# Altium project ESP32_Projet.PrjPcb
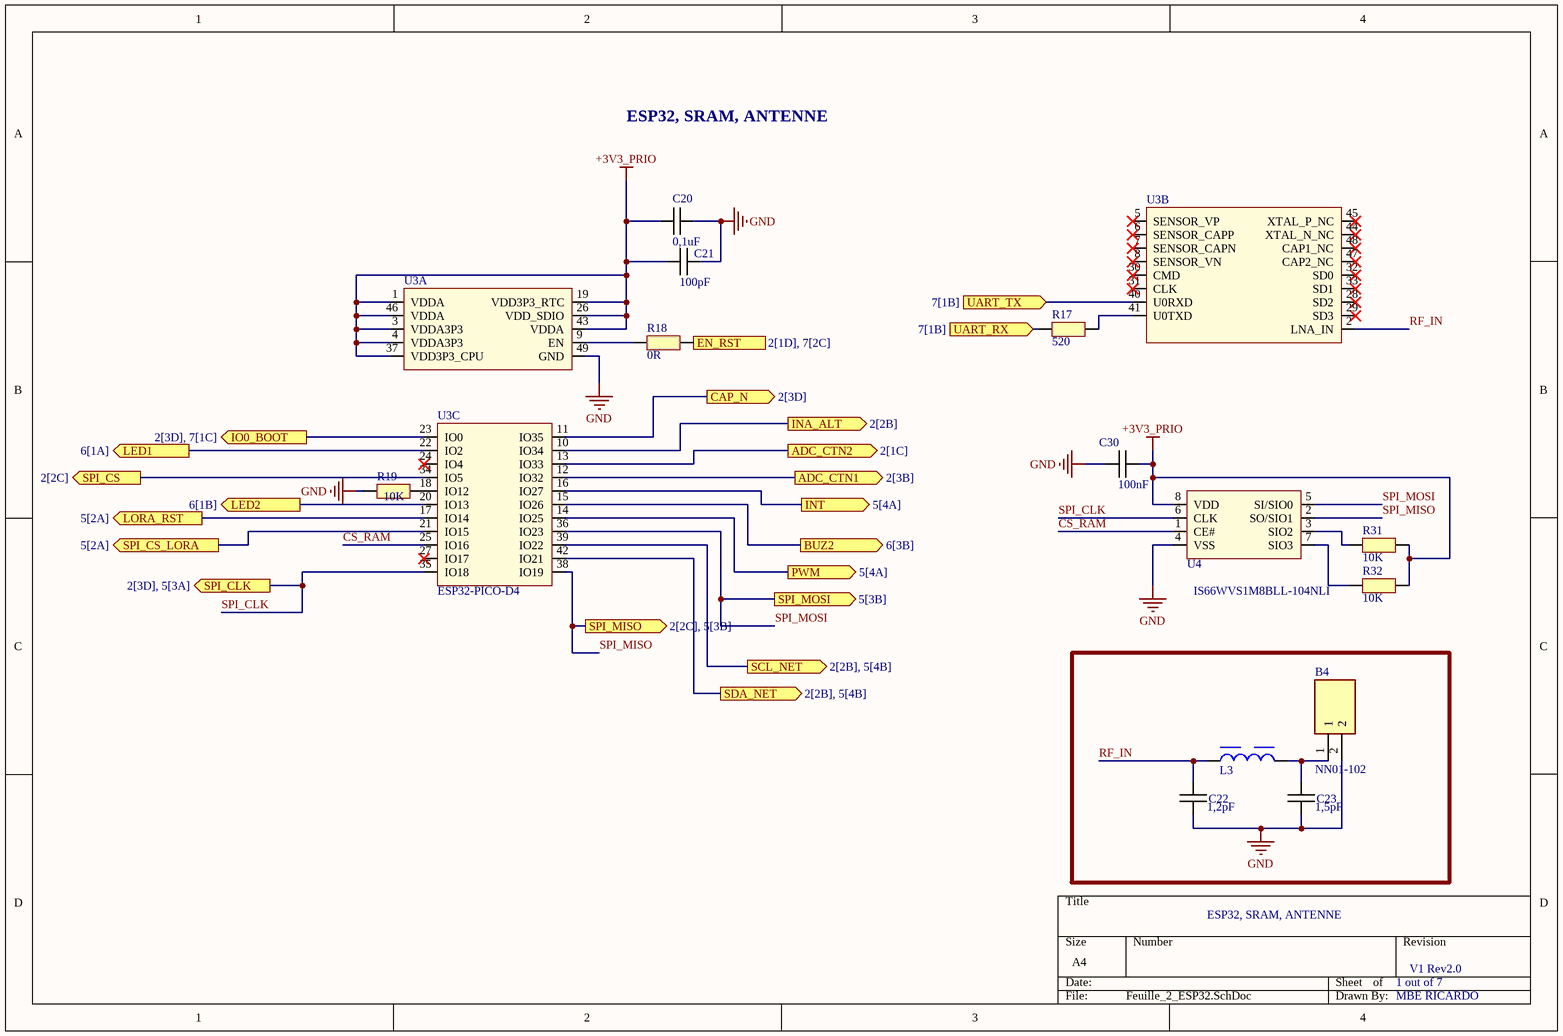
[diagram p0: Feuille_2_ESP32.SchDoc]
7 sheets, 100 parts. Net scope: flat (ports and power ports of the same name join across sheets).
Board file: PCB11.PcbDoc
Sheets:
  Feuille_2_ESP32.SchDoc
  Capteurs.SchDoc
  Circuit de priorité.SchDoc
  Regulateurs.SchDoc
  Connecteurs.SchDoc
  Actionneur.SchDoc
  USB_UART.SchDoc

## Sheet Feuille_2_ESP32.SchDoc
size A4; SheetNumber: 1; SheetTotal: 7

### Parts
B4  NN01-102  [NN01-102]
C20  0,1uF  [CAPC1005X06N]
C21  100pF  [CAPC1005X06N]
C22  1,2pF  [CAPC1005X06N]
C23  1,5pF  [CAPC1005X06N]
C30  100nF  [CAPC1005X06N]
L3  3.3uH, 3.5A  [WE-LHMI_4020]  (value not drawn)
R17  520  [RESC1005X06N]
R18  0R  [RESC1005X06N]
R19  10K  [RESC1005X06N]
R31  10K  [RESC1005X06N]
R32  10K  [RESC1005X06N]
U3  ESP32-PICO-D4  [PQFN50P700X700X104_HS-49N]  (value not drawn)  (parts A,B,C of 3)
U4  IS66WVS1M8BLL-104NLI  [SOIC127P600X175-8N]

### Ports
ADC_CTN1 (out, see 2[3B]), ADC_CTN2 (out, see 2[1C]), BUZ2 (out, see 6[3B]), CAP_N (out, see 2[3D]), EN_RST (out, see 2[1D], 7[2C]), INA_ALT (out, see 2[2B]), INT (out, see 5[4A]), IO0_BOOT (out, see 2[3D], 7[1C]), LED1 (out, see 6[1A]), LED2 (out, see 6[1B]), LORA_RST (out, see 5[2A]), PWM (out, see 5[4A]), SCL_NET (out, see 2[2B], 5[4B]), SDA_NET (out, see 2[2B], 5[4B]), SPI_CLK (out, see 2[3D], 5[3A]), SPI_CS (out, see 2[2C]), SPI_CS_LORA (out, see 5[2A]), SPI_MISO (out, see 2[2C], 5[3B]), SPI_MOSI (out, see 5[3B]), UART_RX (in, see 7[1B]), UART_TX (in, see 7[1B])

### Nets
+3V3_PRIO: C20.1 C21.2 C30.2 R31.1 R32.1 U3.1(VDDA) U3.3(VDDA3P3) U3.4(VDDA3P3) U3.19(VDD3P3_RTC) U3.26(VDD_SDIO) U3.37(VDD3P3_CPU) U3.43(VDDA) U3.46(VDDA) U4.8(VDD)
GND: B4.2 C20.2 C21.1 C22.2 C23.2 C30.1 R19.2 U3.49(GND) U4.4(VSS)
CS_RAM: U3.25(IO16) U4.1(CE#)
RF_IN: C22.1 L3.1 U3.2(LNA_IN)
SCL_NET: U3.39(IO22) ; port SCL_NET
SDA_NET: U3.42(IO21) ; port SDA_NET
SPI_CLK: U3.35(IO18) U4.6(CLK) ; port SPI_CLK
SPI_MISO: U3.38(IO19) U4.2(SO/SIO1) ; port SPI_MISO
SPI_MOSI: U3.36(IO23) U4.5(SI/SIO0) ; port SPI_MOSI
NetB1_2: U3.13(IO33) ; port ADC_CTN2
NetB4_1: B4.1 C23.1 L3.2
NetB5_1: U3.34(IO5) ; port SPI_CS
NetB5_5: U3.11(IO35) ; port CAP_N
NetB6_3: U3.10(IO34) ; port INA_ALT
NetB7_2: U3.12(IO32) ; port ADC_CTN1
NetC5_2: R18.1 ; port EN_RST
NetJ4_9: U3.14(IO25) ; port PWM
NetJ4_10: U3.16(IO27) ; port INT
NetQ2_3: U3.23(IO0) ; port IO0_BOOT
NetR14_1: U3.17(IO14) ; port LORA_RST
NetR15_1: U3.21(IO15) ; port SPI_CS_LORA
NetR16_2: U3.22(IO2) ; port LED1
NetR17_1: R17.1 U3.41(U0TXD)
NetR17_2: R17.2 ; port UART_RX
NetR18_2: R18.2 U3.9(EN)
NetR19_1: R19.1 U3.18(IO12)
NetR24_2: U3.20(IO13) ; port LED2
NetR25_2: U3.15(IO26) ; port BUZ2
NetR31_2: R31.2 U4.3(SIO2)
NetR32_2: R32.2 U4.7(SIO3)
NetU1_20: U3.40(U0RXD) ; port UART_TX

Not connected (* = marked no-connect by the designer): U3 5(SENSOR_VP)* 6(SENSOR_CAPP)* 7(SENSOR_CAPN)* 8(SENSOR_VN)* 24(IO4)* 27(IO17)* 28(SD2)* 29(SD3)* 30(CMD)* 31(CLK)* 32(SD0)* 33(SD1)* 44(XTAL_N_NC)* 45(XTAL_P_NC)* 47(CAP2_NC)* 48(CAP1_NC)*

### Notes on the sheet
- ESP32, SRAM, ANTENNE
- 1 out of 7
- V1 Rev2.0
- MBE RICARDO

### Library data of the parts
B4 = NN01-102: Antennes Compact Reach Xtend 2.4 GHz
C20-C23 C30 = Capacitor
L3 = 74437324033: WE-LHMI SMT Power Inductor, size 4020, 3.3uH, 3.5A, 76mOhm; Manufacturer: Wurth Elektronik; Case/Size Code: 4020; DC Resistance: 69mOhm; Saturation Current @ 10%: 2.75A; Saturation Current @ 30%: 5.45A; Self Resonant Frequency: 40MHz; Manufacturer Part Number: 74437324033; Category: Power Inductors; Match Code: WE-LHMI; ComponentLink1Description: Website Link; ComponentLink1URL: https://www.we-online.com/redexpert/article/74437324033?ad; ComponentLink2Description: Datasheet Link; ComponentLink2URL: https://www.we-online.com/redexpert/spec/74437324033?ad; Mount: Surface Mount; Operating Temperature Max: 125°C; Operating Temperature Min: -40°C; Packaging: Tape and Reel; Length: 4.06mm; Width: 4.06mm; Height: 1.8mm; DC Resistance Max: 76mOhm; Inductance: 3.3uH; Performance Rated Current: 3.5A
R17-R19 R31 R32 = Resistor
U3 = ESP32: Système RF sur puce - SoC SIP module ESP32 with 4MByte Flash, Dual Core MCU, Wi-Fi & Bluetooth Combo, LGA48-pin, 7*7mm; Manufacturer 1: Espressif Systems; Supplier 1: Digi-Key; Supplier Part Number 1: 1904-1029-1-ND; Manufacturer Part Number 1: ESP32-PICO-D4
U4 = SRAM: SRAM 8Mb, SerialRAM, 2.7V-3.6V, 104MHz, 8 pin SOIC 150 mil, RoHS; Manufacturer 1: ISSI; Supplier 1: Digi-Key; Supplier Part Number 1: 706-IS66WVS1M8BLL-104NLI-ND; Manufactuer Part Number 1: IS66WVS1M8BLL-104NLI

## Sheet Capteurs.SchDoc
size A4; SheetNumber: 2; SheetTotal: 7
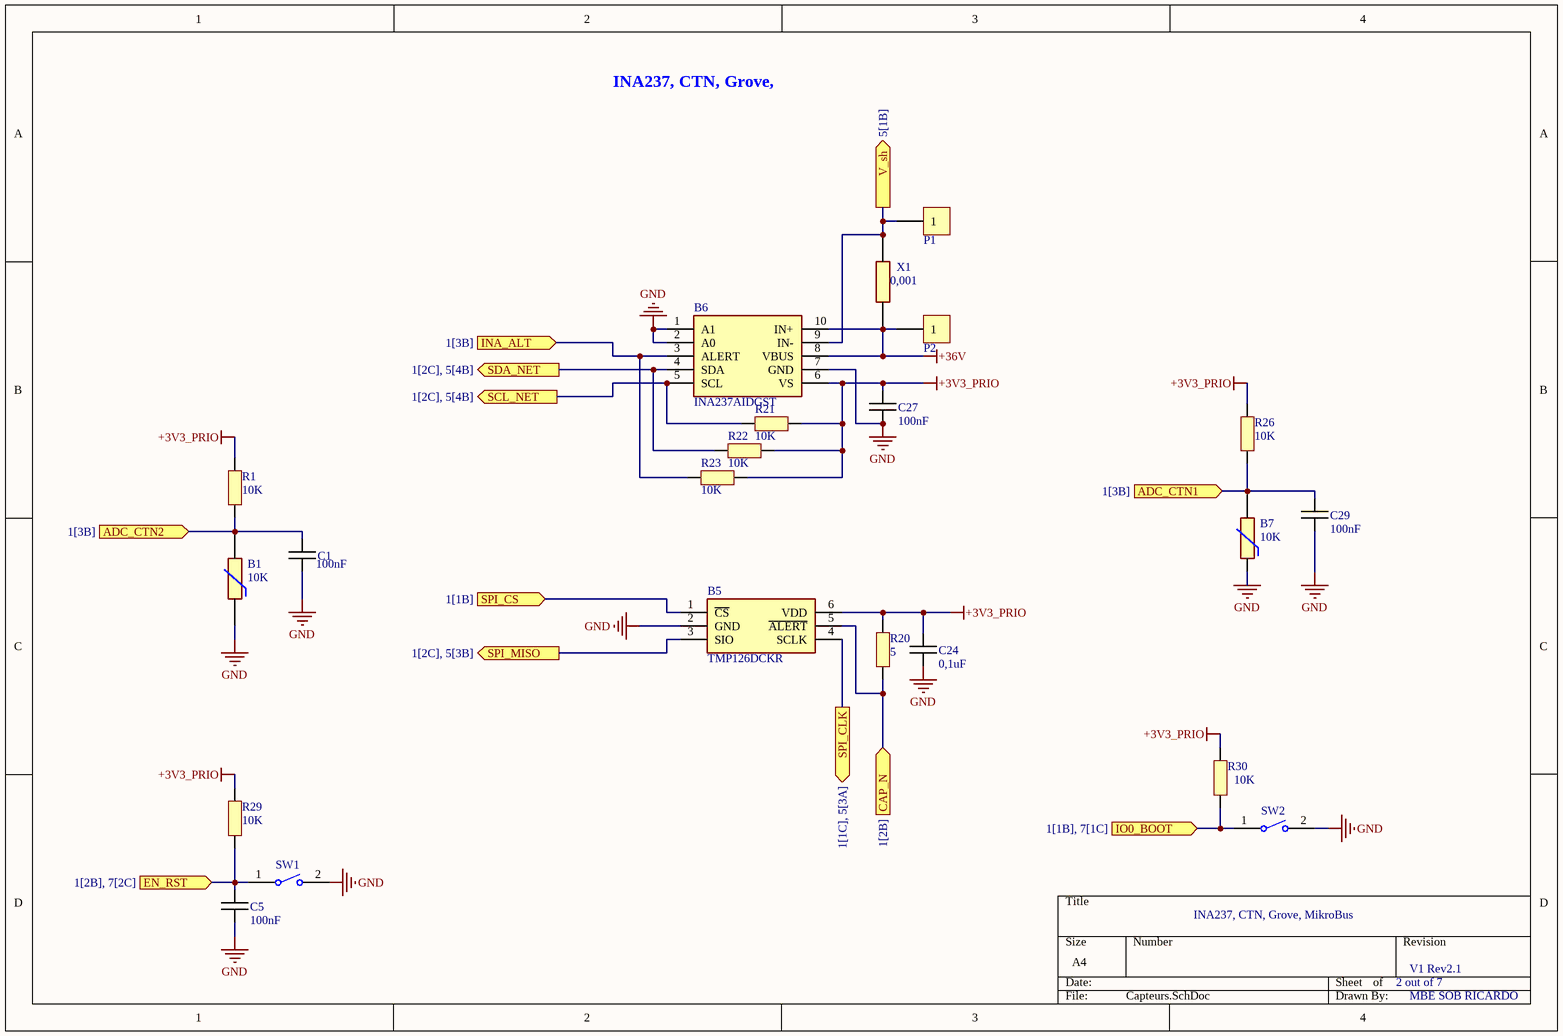
[diagram p1: Capteurs.SchDoc]

### Parts
B1  10K  [RESC2212X50N]
B5  TMP126DCKR  [SOT65P210X110-6N]
B6  INA237AIDGST  [SOP50P490X110-10N]
B7  10K  [RESC2212X50N]
C1  100nF  [CAPC1005X06N]
C5  100nF  [CAPC1005X06N]
C24  0,1uF  [CAPC1005X06N]
C27  100nF  [CAPC1005X06N]
C29  100nF  [CAPC1005X06N]
P1  Plage CMS 10x5  [Plage CMS 10x5]  (value not drawn)  (no BOM)
P2  Plage CMS 10x5  [Plage CMS 10x5]  (value not drawn)  (no BOM)
R1  10K  [RESC1005X06N]
R20  5  [RESC1005X06N]
R21  10K  [RESC1005X06N]
R22  10K  [RESC1005X06N]
R23  10K  [RESC1005X06N]
R26  10K  [RESC1005X06N]
R29  10K  [RESC1005X06N]
R30  10K  [RESC1005X06N]
SW1  FSMSM  [TECO-FSMSM-2_V]  (value not drawn)
SW2  FSMSM  [TECO-FSMSM-2_V]  (value not drawn)
X1  0,001  [RESC10052X200N]

### Ports
ADC_CTN1 (in, see 1[3B]), ADC_CTN2 (in, see 1[3B]), CAP_N (in, see 1[2B]), EN_RST (in, see 1[2B], 7[2C]), INA_ALT (in, see 1[3B]), IO0_BOOT (in, see 1[1B], 7[1C]), SCL_NET (out, see 1[2C], 5[4B]), SDA_NET (out, see 1[2C], 5[4B]), SPI_CLK (out, see 1[1C], 5[3A]), SPI_CS (in, see 1[1B]), SPI_MISO (out, see 1[2C], 5[3B]), V_sh (out, see 5[1B])

### Nets
+3V3_PRIO: B5.6(VDD) B6.6(VS) C24.1 C27.2 R1.2 R20.2 R21.1 R22.1 R23.1 R26.2 R29.1 R30.1
+36V: B6.8(VBUS) B6.10(IN+) P2.1 X1.1
GND: B1.1 B5.2(GND) B6.1(A1) B6.2(A0) B6.7(GND) B7.1 C1.2 C5.1 C24.2 C27.1 C29.1 SW1.2 SW2.2
SCL_NET: B6.5(SCL) R21.2 ; port SCL_NET
SDA_NET: B6.4(SDA) R22.2 ; port SDA_NET
SPI_CLK: B5.4(SCLK) ; port SPI_CLK
SPI_MISO: B5.3(SIO) ; port SPI_MISO
NetB1_2: B1.2 C1.1 R1.1 ; port ADC_CTN2
NetB5_1: B5.1(~{CS}) ; port SPI_CS
NetB5_5: B5.5(~{ALERT}) R20.1 ; port CAP_N
NetB6_3: B6.3(ALERT) R23.2 ; port INA_ALT
NetB6_9: B6.9(IN-) P1.1 X1.2 ; port V_sh
NetB7_2: B7.2 C29.2 R26.1 ; port ADC_CTN1
NetC5_2: C5.2 R29.2 SW1.1 ; port EN_RST
NetQ2_3: R30.2 SW2.1 ; port IO0_BOOT

### Notes on the sheet
- INA237, CTN, Grove, MikroBus
- 2 out of 7
- V1 Rev2.1
- MBE SOB RICARDO

### Library data of the parts
B1 B7 = NB12K00103JBB: NTC SMD Thermistor, NB12K, 10K, 5% AVX 10k 0805 Protection NTC Thermistor, 5s, 2 x 1.25 x 1.3mm; Manufacturer_Name: Kyocera AVX; Geometry.Height: 0.5mm; Manufacturer_Part_Number: NB12K00103JBB; Mouser Part Number: 581-NB12K00103JBB; Mouser Price/Stock: https://www.mouser.co.uk/ProductDetail/AVX/NB12K00103JBB/?qs=4%252B6%252BTdINQeDPvI%252BQUQjJ3Q%3D%3D; Arrow Part Number: NB12K00103JBB; Arrow Price/Stock: https://www.arrow.com/en/products/nb12k00103jbb/avx; Datasheet Link: https://datasheet.datasheetarchive.com/originals/distributors/Datasheets-DGA6/551314.pdf
B5 = TMP126DCKR: Board Mount Temperature Sensors +/-0.25 C SPI temperature sensor with 175 C operation, CRC and slew-rate alert; Manufacturer_Name: Texas Instruments; Manufacturer_Part_Number: TMP126DCKR; Mouser Part Number: 595-TMP126DCKR
B6 = INA237AIDGST: Current Sense Amplifiers 85-V, 16-bit, I2C output current/voltage/power monitor with alert 10-VSSOP -40 to 125; Manufacturer_Name: Texas Instruments; Manufacturer_Part_Number: INA237AIDGST; Mouser Part Number: 595-INA237AIDGST
C1 C5 C24 C27 C29 = Capacitor
P1 P2 = Plage CMS 10x5: Plage de report CMS 10x5mm; PN: L30; Value: Plage CMS 10x5; Footprint_statut: ok
R1 R20-R23 R26 R29 R30 = Resistor
SW1 SW2 = CMP-2000-07511-1: FSMSM Push Button Switch, 50 mA, -35 to 85 degC, 2-Pin SMD, RoHS, Bulk; Manufacturer: TE Connectivity; Actuator Length: 1.07mm; Electrical Life: 20000Cycles; Actuator Material: Polyamide; Current Rating: 50mA; Illumination Type: Illuminated; Voltage Rating (DC): 24V; Contact Resistance: 100mOhm; Case\/Package: SMD/SMT; Operating Force: 180gf; Switch Travel: 0.25mm; Max Voltage Rating (DC): 12V; Throw Configuration: SPST; Packaging: LoosePiece; Max Operating Temperature: 85degC; ELV: Compliant; Package Description: 2-Pin Surface Mount Device, Body 6 x 3.5 mm, Pitch 9.19 mm; RoHSCompliant: true; Manufacturer URL: http://www.te.com/; Contact Plating: Silver; Contact Material: Brass; Mounting Technology: SurfaceMount; Contact Current Rating: 50mA; Datasheet Version: Rev. C2, 08/2014; Datasheet URL: http://www.te.com/commerce/DocumentDelivery/DDEController?Action=showdoc&DocId=Customer+Drawing%7F1437566-3%7FC2%7Fpdf%7FEnglish%7FENG_CD_1437566-3_C2_1437566_3_1_c.dwg.pdf%7F1437566-3; Mechanical Life: 20000Cycles; Package Reference: FSMSM; REACH SVHC: Unknown; Orientation: Straight; Min Operating Temperature: -35degC; Lead Free: LeadFree; Termination: GullWing; Package Quantity: 1000; Mount: SurfaceMount
X1 = PSR400ITQFF0L50: ROHM - PSR400ITQFF0L50 - SMD Current Sense Resistor, 500 ohm, PSR Series, 3921 [1052 Metric], 4 W, +/- 1%, Metal Strip; Manufacturer_Name: ROHM Semiconductor; Geometry.Height: 2mm; Manufacturer_Part_Number: PSR400ITQFF0L50; Mouser Part Number: 755-PSR400ITQFF0L50; Mouser Price/Stock: https://www.mouser.co.uk/ProductDetail/ROHM-Semiconductor/PSR400ITQFF0L50?qs=493kPxzlxfLaT1w5Mo%252BtHg%3D%3D; Arrow Part Number: *; Arrow Price/Stock: *; Datasheet Link: https://componentsearchengine.com/Datasheets/2/PSR400ITQFF0L50.pdf

## Sheet Circuit de priorité.SchDoc
size A4; SheetNumber: 3; SheetTotal: 7
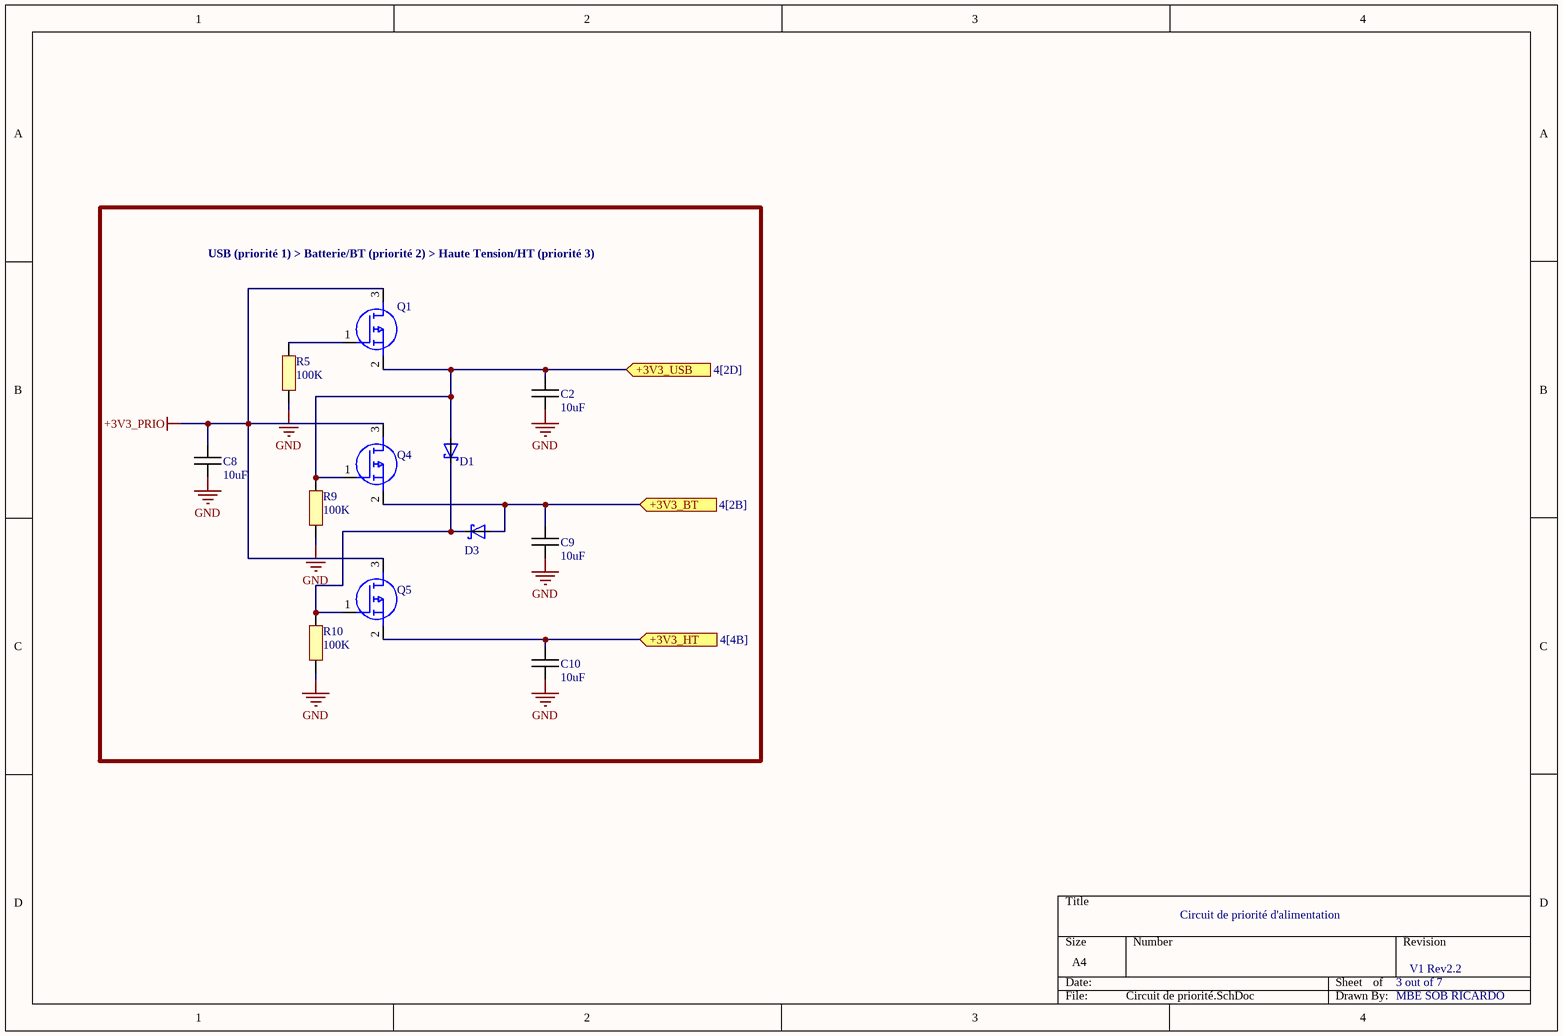
[diagram p2: Circuit de priorité.SchDoc]

### Parts
C2  10uF  [CAPC1005X06N]
C8  10uF  [CAPC1005X06N]
C9  10uF  [CAPC1005X06N]
C10  10uF  [CAPC1005X06N]
D1  SD103AWS-7-F  [SD103AWS-7-F]  (value not drawn)
D3  SD103AWS-7-F  [SD103AWS-7-F]  (value not drawn)
Q1  SI3139K-TP  [SI3139K-TP]  (value not drawn)
Q4  SI3139K-TP  [SI3139K-TP]  (value not drawn)
Q5  SI3139K-TP  [SI3139K-TP]  (value not drawn)
R5  100K  [RESC1005X06N]
R9  100K  [RESC1005X06N]
R10  100K  [RESC1005X06N]

### Ports
+3V3_BT (in, see 4[2B]), +3V3_HT (in, see 4[4B]), +3V3_USB (in, see 4[2D])

### Nets
+3V3_PRIO: C8.1 Q1.3(D) Q4.3(D) Q5.3(D)
GND: C2.2 C8.2 C9.2 C10.2 R5.2 R9.2 R10.2
NetB2_5: C9.1 D3.2(A) Q4.2(S) ; port +3V3_BT
NetC2_1: C2.1 D1.2(A) Q1.2(S) Q4.1(G) R9.1 ; port +3V3_USB
NetC10_1: C10.1 Q5.2(S) ; port +3V3_HT
NetD1_1: D1.1(C) D3.1(C) Q5.1(G) R10.1
NetQ1_1: Q1.1(G) R5.1

### Notes on the sheet
- (near Q1) USB (priorité 1) > Batterie/BT (priorité 2) > Haute Tension/HT (priorité 3)
- Circuit de priorité d'alimentation
- 3 out of 7
- V1 Rev2.2
- MBE SOB RICARDO

### Library data of the parts
C2 C8-C10 = Capacitor
D1 D3 = SD103AWS-7-F: Diode Array 3 Independent Schottky 40V 175mA Surface Mount 6-TSSOP, SC-88, SOT-363
Q1 Q4 Q5 = SI3139K-TP: MOSFET P-Channel MOSFET
R5 R9 R10 = Resistor

## Sheet Regulateurs.SchDoc
size A4; SheetNumber: 4; SheetTotal: 7
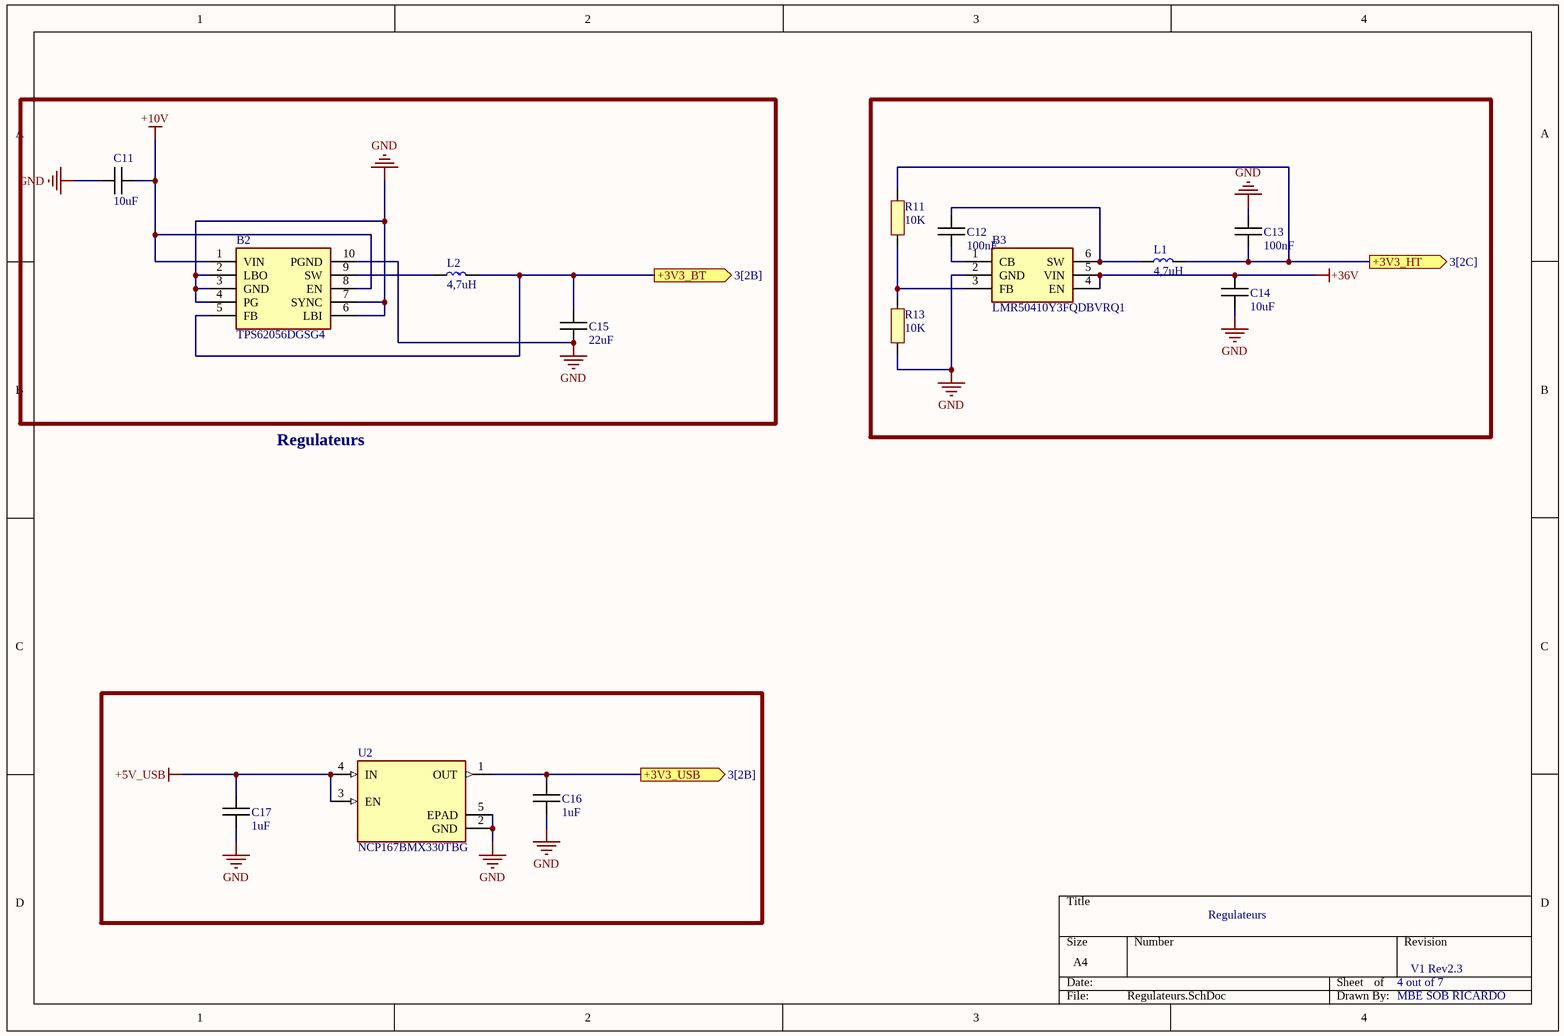
[diagram p3: Regulateurs.SchDoc]

### Parts
B2  TPS62056DGSG4  [SOP50P490X110-10N]
B3  LMR50410Y3FQDBVRQ1  [SOT95P280X145-6N]
C11  10uF  [CAPC1005X06N]
C12  100nF  [CAPC1005X06N]
C13  100nF  [CAPC1005X06N]
C14  10uF  [CAPC1005X06N]
C15  22uF  [CAPC1005X06N]
C16  1uF  [CAPC1005X06N]
C17  1uF  [CAPC1005X06N]
L1  4,7uH  [LQPC1005X06N]
L2  4,7uH  [LQPC1005X06N]
R11  10K  [RESC1005X06N]
R13  10K  [RESC1005X06N]
U2  NCP167BMX330TBG  [NCP167BMX330TBG]

### Ports
+3V3_BT (out, see 3[2B]), +3V3_HT (out, see 3[2C]), +3V3_USB (out, see 3[2B])

### Nets
+5V_USB: C17.2 U2.3(EN) U2.4(IN)
+10V: B2.1(VIN) B2.8(EN) C11.1
+36V: B3.4(EN) B3.5(VIN) C14.2
GND: B2.2(LBO) B2.3(GND) B2.4(PG) B2.6(LBI) B2.7(SYNC) B2.10(PGND) B3.2(GND) C11.2 C13.2 C14.1 C15.2 C16.1 C17.1 R13.1 U2.2(GND) U2.5(EPAD)
NetB2_5: B2.5(FB) C15.1 L2.2 ; port +3V3_BT
NetB2_9: B2.9(SW) L2.1
NetB3_1: B3.1(CB) C12.1
NetB3_3: B3.3(FB) R11.1 R13.2
NetB3_6: B3.6(SW) C12.2 L1.1
NetC2_1: C16.2 U2.1(OUT) ; port +3V3_USB
NetC10_1: C13.1 L1.2 R11.2 ; port +3V3_HT

### Notes on the sheet
- Regulateurs
- 4 out of 7
- V1 Rev2.3
- MBE SOB RICARDO

### Library data of the parts
B2 = TPS62056DGSG4: TEXAS INSTRUMENTS - TPS62056DGSG4 - Synchronous Buck (Step Down) Switching Regulator, Fixed, 2.7V-10Vin, 3.3V/0.8A out, 850kHz, VSSOP-10; Manufacturer_Name: Texas Instruments; Manufacturer_Part_Number: TPS62056DGSG4; Mouser Part Number: 595-TPS62056DGSG4
B3 = LMR50410Y3FQDBVRQ1: Régulateurs de tension de commutation Automotive qualified SIMPLE SWITCHER 4-V to 36-V, 1-A synchronous step-down converter 6-SOT-23 -40 to 150; Manufacturer_Name: Texas Instruments; Manufacturer_Part_Number: LMR50410Y3FQDBVRQ1; Mouser Part Number: 595-R50410Y3FQDBVRQ1
C11-C17 = Capacitor
L1 L2 = Bobine
R11 R13 = Resistor
U2 = NCP167BMX330TBG: Régulateurs de tension LDO LDO 700 MA ULTRA-LOW NOISE 3.3V

## Sheet Connecteurs.SchDoc
size A4; SheetNumber: 5; SheetTotal: 7
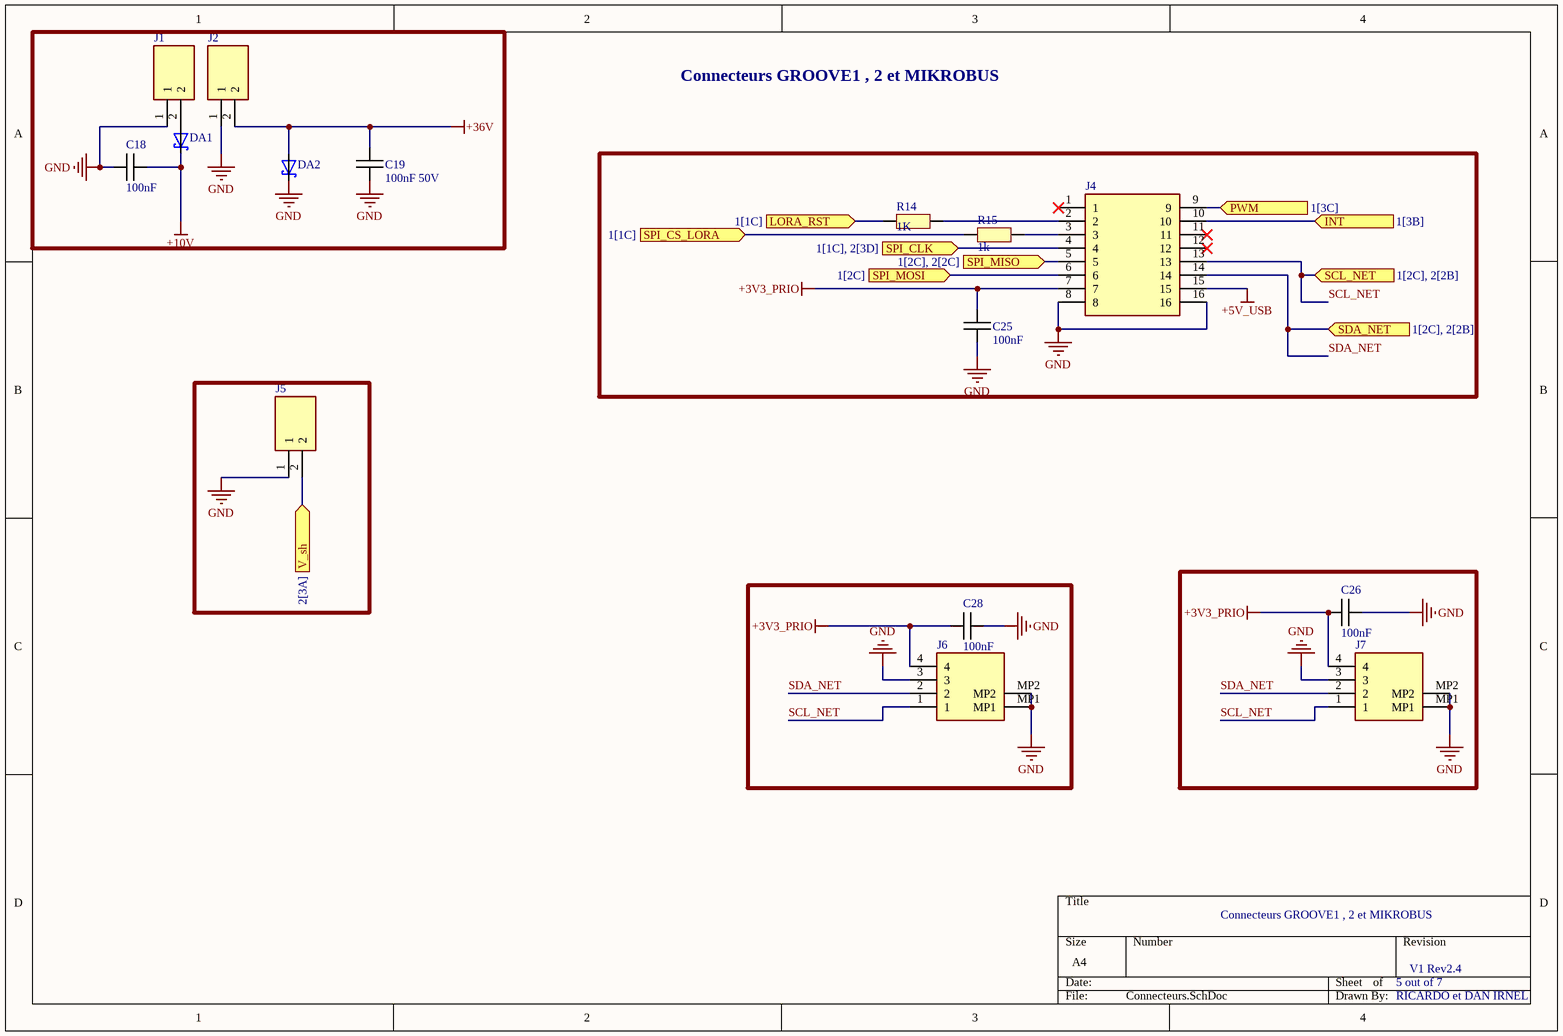
[diagram p4: Connecteurs.SchDoc]

### Parts
C18  100nF  [CAPC1005X06N]
C19  100nF 50V  [CAPC1005X06N]
C25  100nF  [CAPC1005X06N]
C26  100nF  [CAPC1005X06N]
C28  100nF  [CAPC1005X06N]
DA1  SD103AWS-7-F  [SD103AWS-7-F]  (value not drawn)
DA2  SD103AWS-7-F  [SD103AWS-7-F]  (value not drawn)
J1  61300211121  [61300211121]  (value not drawn)
J2  61300211121  [61300211121]  (value not drawn)
J4  825433-8  [Connect-Mikrobus]  (value not drawn)
J5  61300211121  [61300211121]  (value not drawn)
J6  114020164  [114020164]  (value not drawn)
J7  114020164  [114020164]  (value not drawn)
R14  1K  [RESC1005X06N]
R15  1k  [RESC1005X06N]

### Ports
INT (in, see 1[3B]), LORA_RST (in, see 1[1C]), PWM (in, see 1[3C]), SCL_NET (in, see 1[2C], 2[2B]), SDA_NET (in, see 1[2C], 2[2B]), SPI_CLK (in, see 1[1C], 2[3D]), SPI_CS_LORA (in, see 1[1C]), SPI_MISO (in, see 1[2C], 2[2C]), SPI_MOSI (in, see 1[2C]), V_sh (in, see 2[3A])

### Nets
+3V3_PRIO: C25.1 C26.2 C28.2 J4.7 J6.4 J7.4
+5V_USB: J4.15
+10V: C18.1 DA1.1(C)
+36V: C19.1 DA2.2(A) J2.2
GND: C18.2 C19.2 C25.2 C26.1 C28.1 DA2.1(C) J1.1 J2.1 J4.8 J4.16 J5.1 J6.3 J6.MP1 J6.MP2 J7.3 J7.MP1 J7.MP2
SCL_NET: J4.13 J6.1 J7.1 ; port SCL_NET
SDA_NET: J4.14 J6.2 J7.2 ; port SDA_NET
SPI_CLK: J4.4 ; port SPI_CLK
SPI_MISO: J4.5 ; port SPI_MISO
SPI_MOSI: J4.6 ; port SPI_MOSI
NetB6_9: J5.2 ; port V_sh
NetDA1_2: DA1.2(A) J1.2
NetJ4_2: J4.2 R14.2
NetJ4_3: J4.3 R15.2
NetJ4_9: J4.9 ; port PWM
NetJ4_10: J4.10 ; port INT
NetR14_1: R14.1 ; port LORA_RST
NetR15_1: R15.1 ; port SPI_CS_LORA

Not connected (* = marked no-connect by the designer): J4 1* 11* 12*

### Notes on the sheet
- Connecteurs GROOVE1 , 2 et MIKROBUS
- 5 out of 7
- V1 Rev2.4
- RICARDO et DAN IRNEL

### Library data of the parts
C18 C19 C25 C26 C28 = Capacitor
DA1 DA2 = SD103AWS-7-F: as D1 on sheet Circuit de priorité
J1 J2 J5 = 61300211121: WURTH ELEKTRONIK - 61300211121 - HEADER, 2.54MM, PIN, THT, VERTICAL, 2WAY
J4 = Connect-Mikrobus: Headers & Wire Housings 8P double for connection mikrobus; Manufacturer_Name: TE Connectivity; Manufacturer_Part_Number: 825433-8; Mouser Part Number: 571-825433-8
J6 J7 = 114020164: Seeed Studio Accessories Grove Female Header - SMD-4P-2.0mm-90D-20Pcs; Manufacturer_Name: Seeed Studio; Manufacturer_Part_Number: 114020164; Mouser Part Number: 713-114020164
R14 R15 = Resistor

## Sheet Actionneur.SchDoc
size A4; SheetNumber: 6; SheetTotal: 7
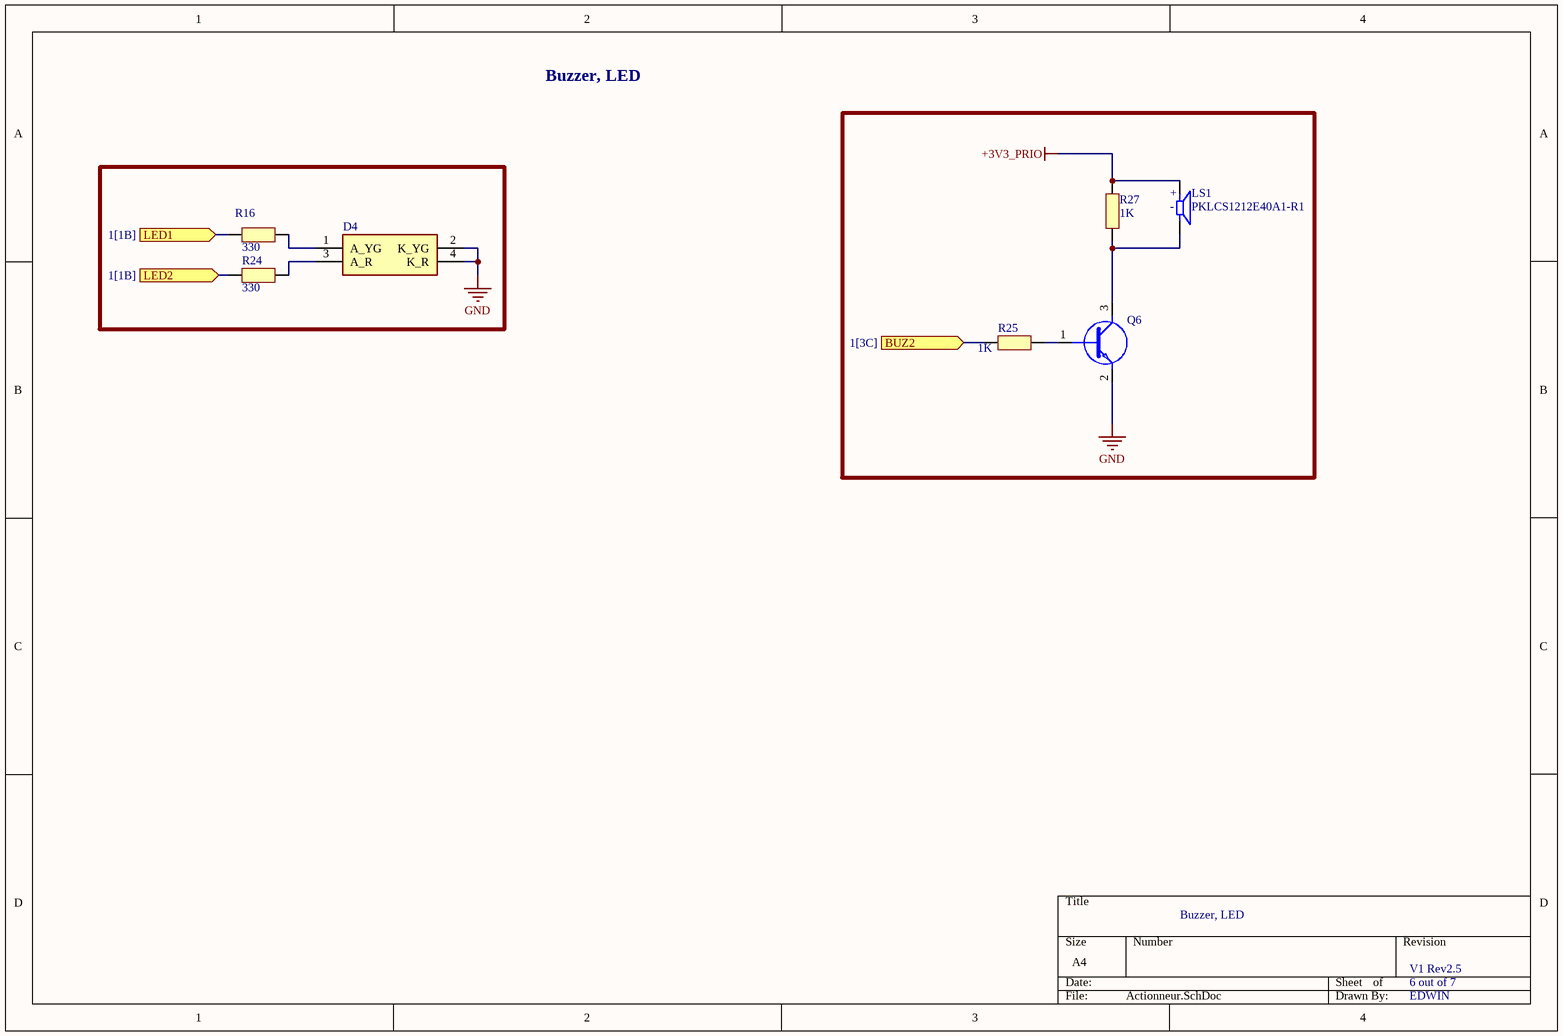
[diagram p5: Actionneur.SchDoc]

### Parts
D4  598-8610-207F  [5988610207F]  (value not drawn)
LS1  PKLCS1212E40A1-R1  [SPKR_PKLCS1212E40A1-R1]
Q6  SS8050-G  [SS8050-G]  (value not drawn)
R16  330  [RESC1005X06N]
R24  330  [RESC1005X06N]
R25  1K  [RESC1005X06N]
R27  1K  [RESC1005X06N]

### Ports
BUZ2 (in, see 1[3C]), LED1 (in, see 1[1B]), LED2 (in, see 1[1B])

### Nets
+3V3_PRIO: LS1.P R27.1
GND: D4.2(K_YG) D4.4(K_R) Q6.2(E)
NetD4_1: D4.1(A_YG) R16.1
NetD4_3: D4.3(A_R) R24.1
NetLS1_N: LS1.N Q6.3(C) R27.2
NetQ6_1: Q6.1(B) R25.1
NetR16_2: R16.2 ; port LED1
NetR24_2: R24.2 ; port LED2
NetR25_2: R25.2 ; port BUZ2

### Notes on the sheet
- Buzzer, LED
- 6 out of 7
- V1 Rev2.5
- EDWIN
- (in symbol PKLCS1212E40A1-R1) +; -

### Library data of the parts
D4 = 598-8610-207F: Standard LEDs - SMD Red/Green WC 80/50mcd 645/570nm; Manufacturer_Name: Dialight; Geometry.Height: 0.8mm; Manufacturer_Part_Number: 598-8610-207F; Mouser Part Number: 645-598-8610-207F; Mouser Price/Stock: https://www.mouser.co.uk/ProductDetail/Dialight/598-8610-207F?qs=7JStj%2FjQ2SFuCjosqwklHQ%3D%3D; Arrow Part Number: 598-8610-207F; Arrow Price/Stock: https://www.arrow.com/en/products/598-8610-207f/dialight?region=nac; Datasheet Link: https://media.digikey.com/pdf/Data%20Sheets/Dialight%20PDFs/598%20Series%201210%20Pkg%20Bi-Color.pdf
LS1 = PKLCS1212E40A1-R1: Buzzers Transducer, Externally Driven Piezo 1.5V 2kHz 70dB @ 1.5V, 10cm Surface Mount Solder Pads; MF: Murata Electronics; Value: *; MP: PKLCS1212E40A1-R1; Package: None; Availability: Unavailable; Price: None
Q6 = SS8050-G: Bipolar Transistors - BJT NPN TRANSISTOR 1.5A 40V
R16 R24 R25 R27 = Resistor

## Sheet USB_UART.SchDoc
size A4; SheetNumber: 7; SheetTotal: 7
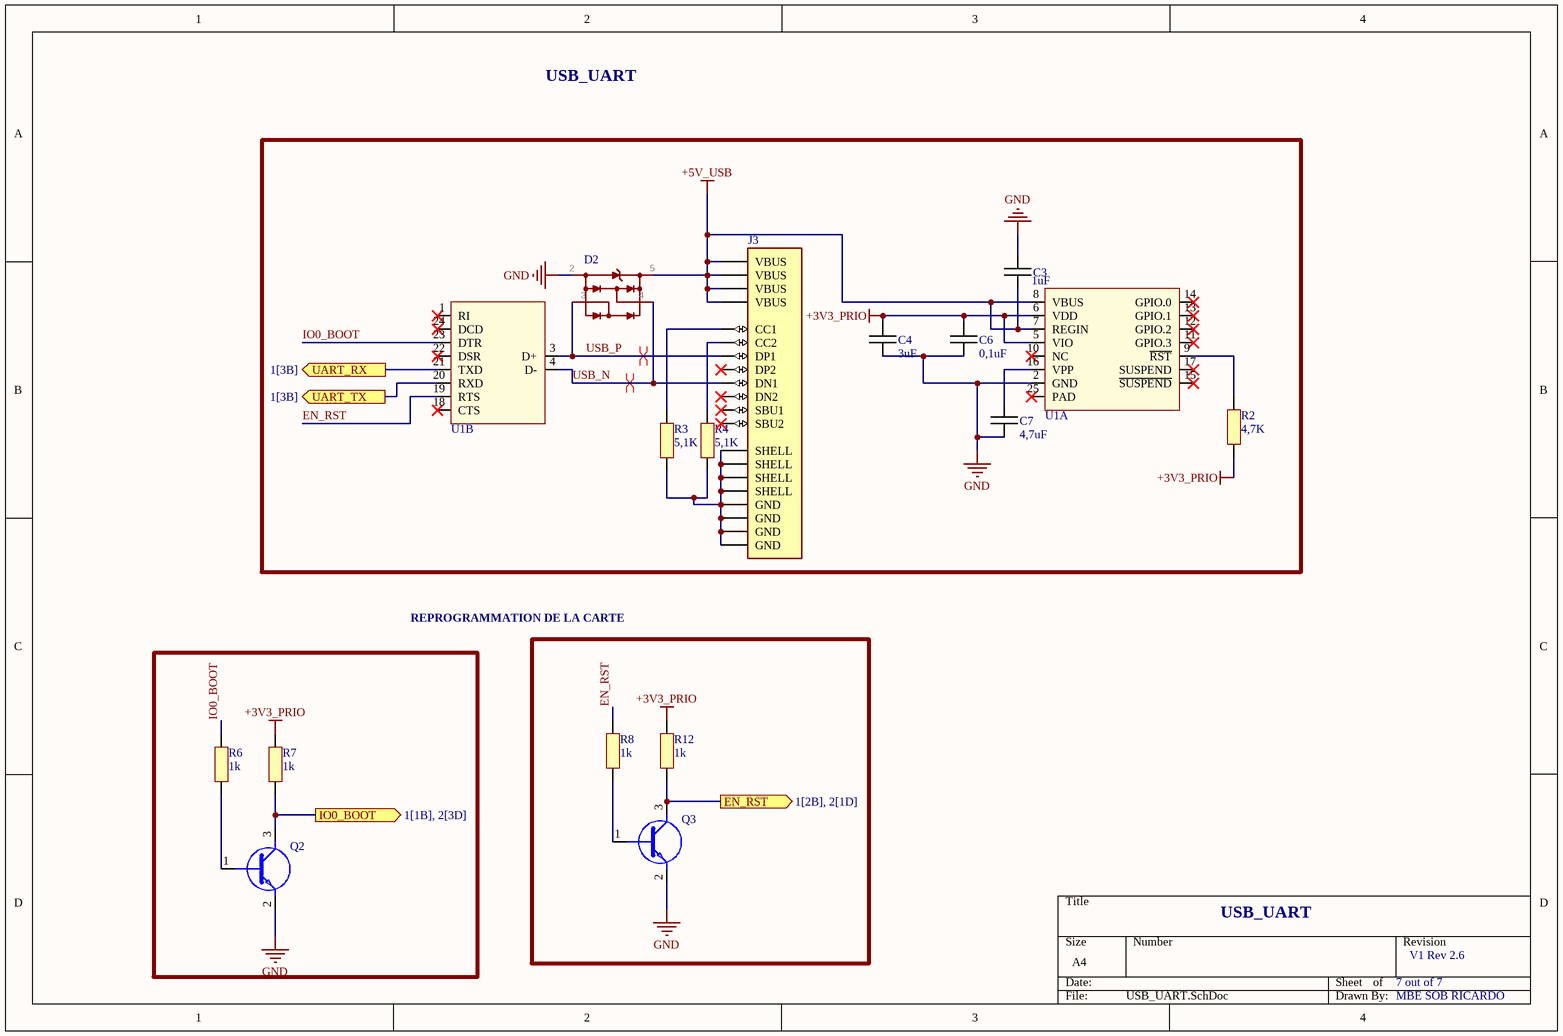
[diagram p6: USB_UART.SchDoc]

### Parts
C3  1uF  [CAPC1005X06N]
C4  3uF  [CAPC1005X06N]
C6  0,1uF  [CAPC1005X06N]
C7  4,7uF  [CAPC1005X06N]
D2  824011  [824011]  (value not drawn)
J3  Use  [USB4085-GF-A]  (value not drawn)
Q2  SS8050-G  [SS8050-G]  (value not drawn)
Q3  SS8050-G  [SS8050-G]  (value not drawn)
R2  4,7K  [RESC1005X06N]
R3  5,1K  [RESC1005X06N]
R4  5,1K  [RESC1005X06N]
R6  1k  [RESC1005X06N]
R7  1k  [RESC1005X06N]
R8  1k  [RESC1005X06N]
R12  1k  [RESC1005X06N]
U1  CP2104-F03-GM  [PQFN50P400X400X80_HS-25N]  (value not drawn)  (parts A,B of 2)

### Ports
EN_RST (out, see 1[2B], 2[1D]), IO0_BOOT (out, see 1[1B], 2[3D]), UART_RX (out, see 1[3B]), UART_TX (out, see 1[3B])

### Nets
+3V3_PRIO: C4.1 C6.1 R2.2 R7.1 R12.1 U1.5(VIO) U1.6(VDD)
+5V_USB: C3.2 D2.5(VDD) J3.A4(VBUS) J3.A9(VBUS) J3.B4(VBUS) J3.B9(VBUS) U1.7(REGIN) U1.8(VBUS)
GND: C3.1 C4.2 C6.2 C7.2 D2.2(GND) Q2.2(E) Q3.2(E) U1.2(GND)
EN_RST: R8.1 U1.19(RTS)
IO0_BOOT: R6.1 U1.23(DTR)
USB_N: D2.4 J3.A7(DN1) U1.4(D-)
USB_P: D2.3 J3.A6(DP1) U1.3(D+)
NetC5_2: Q3.3(C) R12.2 ; port EN_RST
NetC7_1: C7.1 U1.16(VPP)
NetJ3_A1: J3.A1(GND) J3.A12(GND) J3.B1(GND) J3.B12(GND) J3.S1(SHELL) J3.S2(SHELL) J3.S3(SHELL) J3.S4(SHELL) R3.2 R4.2
NetJ3_A5: J3.A5(CC1) R3.1
NetJ3_B5: J3.B5(CC2) R4.1
NetQ2_1: Q2.1(B) R6.2
NetQ2_3: Q2.3(C) R7.2 ; port IO0_BOOT
NetQ3_1: Q3.1(B) R8.2
NetR2_1: R2.1 U1.9(~{RST})
NetR17_2: U1.21(TXD) ; port UART_RX
NetU1_20: U1.20(RXD) ; port UART_TX

Not connected (* = marked no-connect by the designer): J3 A8(SBU1)* B6(DP2)* B7(DN2)* B8(SBU2)*; U1 1(RI)* 10(NC)* 11(GPIO.3)* 12(GPIO.2)* 13(GPIO.1)* 14(GPIO.0)* 15(~{SUSPEND})* 17(SUSPEND)* 18(CTS)* 22(DSR)* 24(DCD)* 25(PAD)*

### Layout directives
differential pair: USB_N, USB_P

### Notes on the sheet
- USB_UART
- REPROGRAMMATION DE LA CARTE
- 7 out of 7
- V1 Rev 2.6
- MBE SOB RICARDO

### Library data of the parts
C3 C4 C6 C7 = Capacitor
D2 = 824011: TVS Diode Array WE-TVS, High Speed Series  - Low capazity - No leakage current - Low clamping voltage - high ESD voltage protection  -- USB 1.0 - 2.0
J3 = USB4085-GF-A: Connecteurs USB USB Type C, 2.0, Rec, TH , G/F, RA , Top Mnt, T & R
Q2 Q3 = SS8050-G: as Q6 on sheet Actionneur
R2-R4 R6-R8 R12 = Resistor
U1 = USBBridge: USB Bridge, USB to UART USB 2.0 UART Interface 24-QFN (4x4); Manufacturer 1: Silicon Labs; Supplier 1: Arrow Electronics; Supplier Part Number 1: CP2104-F03-GM; Manufacturer Part Number 1: CP2104-F03-GM

## Nets that join several sheets
+3V3_PRIO: Feuille_2_ESP32 (14 pins), Capteurs (12 pins), Circuit de priorité (C8.1 Q1.3 Q4.3 Q5.3), Connecteurs (6 pins), Actionneur (LS1.P R27.1), USB_UART (7 pins)
+5V_USB: Regulateurs (C17.2 U2.3 U2.4), Connecteurs (J4.15), USB_UART (8 pins)
+10V: Regulateurs (B2.1 B2.8 C11.1), Connecteurs (C18.1 DA1.1)
+36V: Capteurs (B6.8 B6.10 P2.1 X1.1), Regulateurs (B3.4 B3.5 C14.2), Connecteurs (C19.1 DA2.2 J2.2)
GND: Feuille_2_ESP32 (9 pins), Capteurs (13 pins), Circuit de priorité (7 pins), Regulateurs (16 pins), Connecteurs (17 pins), Actionneur (D4.2 D4.4 Q6.2), USB_UART (8 pins)
NetB1_2: Feuille_2_ESP32 (U3.13), Capteurs (B1.2 C1.1 R1.1)
NetB2_5: Circuit de priorité (C9.1 D3.2 Q4.2), Regulateurs (B2.5 C15.1 L2.2)
NetB5_1: Feuille_2_ESP32 (U3.34), Capteurs (B5.1)
NetB5_5: Feuille_2_ESP32 (U3.11), Capteurs (B5.5 R20.1)
NetB6_3: Feuille_2_ESP32 (U3.10), Capteurs (B6.3 R23.2)
NetB6_9: Capteurs (B6.9 P1.1 X1.2), Connecteurs (J5.2)
NetB7_2: Feuille_2_ESP32 (U3.12), Capteurs (B7.2 C29.2 R26.1)
NetC2_1: Circuit de priorité (5 pins), Regulateurs (C16.2 U2.1)
NetC5_2: Feuille_2_ESP32 (R18.1), Capteurs (C5.2 R29.2 SW1.1), USB_UART (Q3.3 R12.2)
NetC10_1: Circuit de priorité (C10.1 Q5.2), Regulateurs (C13.1 L1.2 R11.2)
NetJ4_9: Feuille_2_ESP32 (U3.14), Connecteurs (J4.9)
NetJ4_10: Feuille_2_ESP32 (U3.16), Connecteurs (J4.10)
NetQ2_3: Feuille_2_ESP32 (U3.23), Capteurs (R30.2 SW2.1), USB_UART (Q2.3 R7.2)
NetR14_1: Feuille_2_ESP32 (U3.17), Connecteurs (R14.1)
NetR15_1: Feuille_2_ESP32 (U3.21), Connecteurs (R15.1)
NetR16_2: Feuille_2_ESP32 (U3.22), Actionneur (R16.2)
NetR17_2: Feuille_2_ESP32 (R17.2), USB_UART (U1.21)
NetR24_2: Feuille_2_ESP32 (U3.20), Actionneur (R24.2)
NetR25_2: Feuille_2_ESP32 (U3.15), Actionneur (R25.2)
NetU1_20: Feuille_2_ESP32 (U3.40), USB_UART (U1.20)
SCL_NET: Feuille_2_ESP32 (U3.39), Capteurs (B6.5 R21.2), Connecteurs (J4.13 J6.1 J7.1)
SDA_NET: Feuille_2_ESP32 (U3.42), Capteurs (B6.4 R22.2), Connecteurs (J4.14 J6.2 J7.2)
SPI_CLK: Feuille_2_ESP32 (U3.35 U4.6), Capteurs (B5.4), Connecteurs (J4.4)
SPI_MISO: Feuille_2_ESP32 (U3.38 U4.2), Capteurs (B5.3), Connecteurs (J4.5)
SPI_MOSI: Feuille_2_ESP32 (U3.36 U4.5), Connecteurs (J4.6)

## Assembly variants
rev A: all parts fitted